# EasyEDA schematic SCH - USB Passthrough v2.0.json
TITLE: USB Passthrough Board; REV: 2.0; Date: 2023-07-30; Sheet: 1/1; Drawn By: TheTrain; Company: Open Stick Community
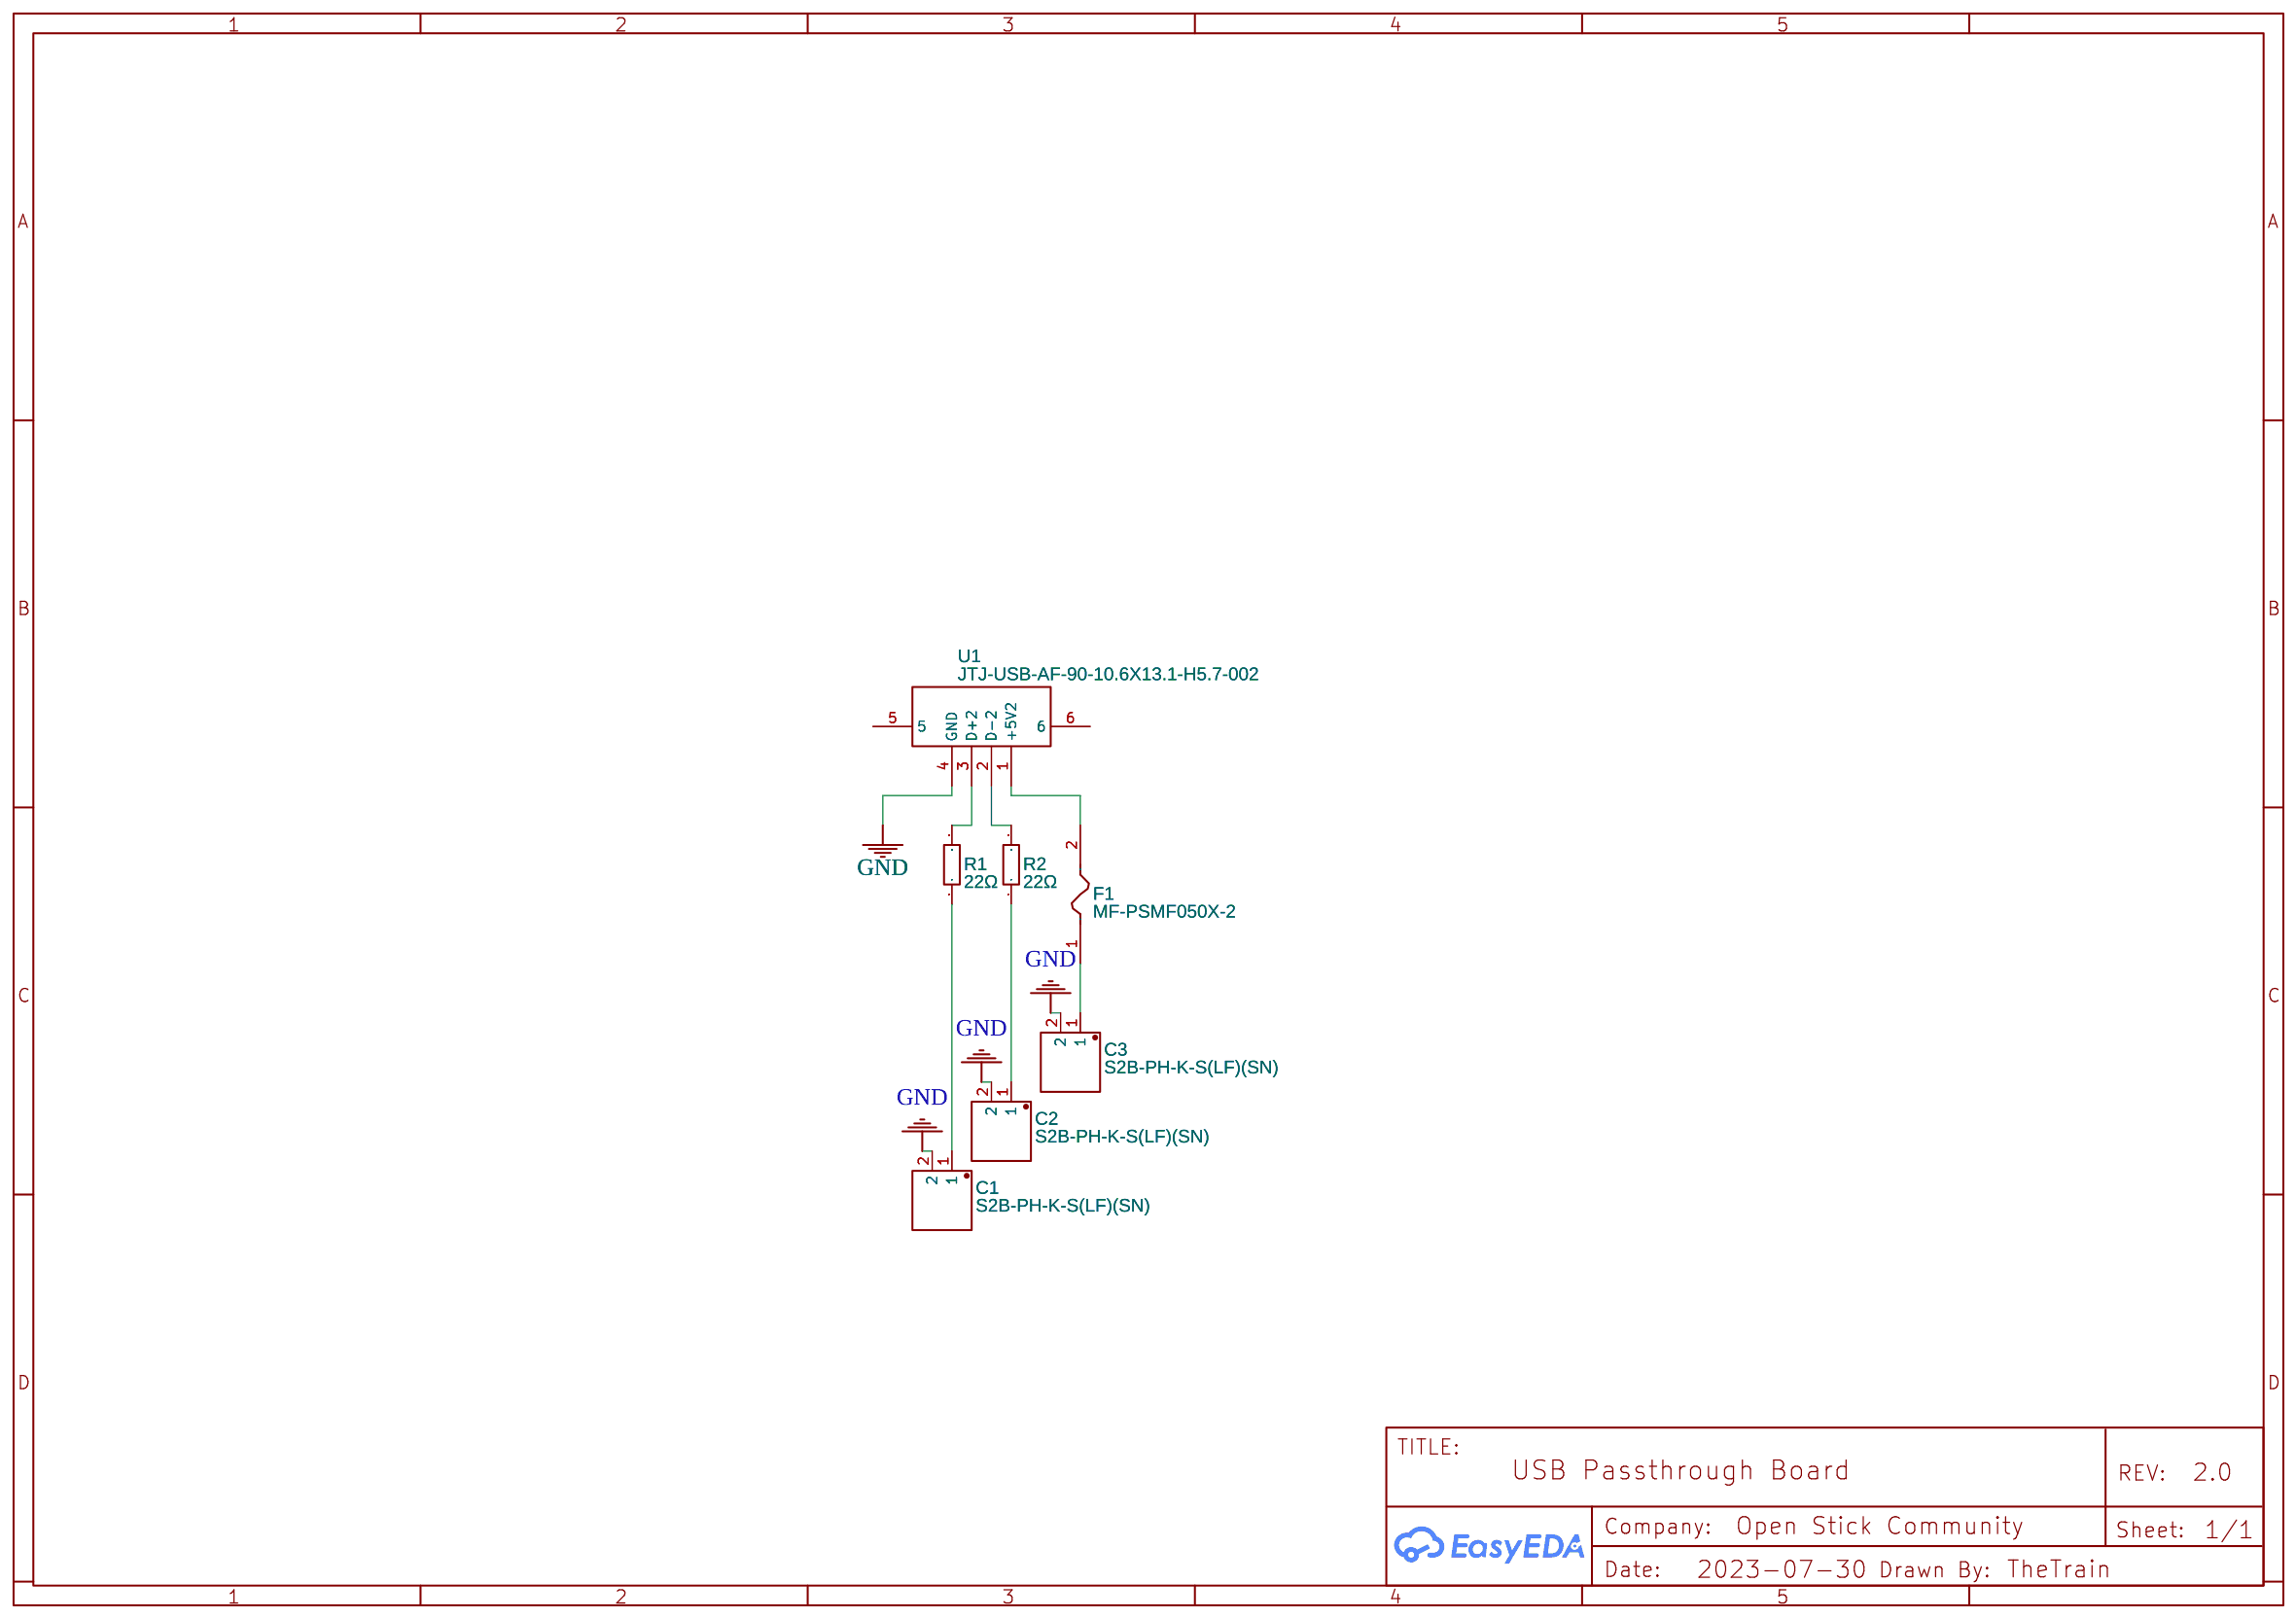
[diagram p0: schematic sheet]

## Parts
C1  S2B-PH-K-S(LF)(SN)  [CONN-TH_S2B-PH-K-S-LF-SN]
C2  S2B-PH-K-S(LF)(SN)  [CONN-TH_S2B-PH-K-S-LF-SN]
C3  S2B-PH-K-S(LF)(SN)  [CONN-TH_S2B-PH-K-S-LF-SN]
F1  MF-PSMF050X-2  [F0805]
R1  22Ω  [R0603]
R2  22Ω  [R0603]
U1  JTJ-USB-AF-90-10.6X13.1-H5.7-002  [USB-A-TH_C42425]

## Library data of the parts
C1-C3 = S2B-PH-K-S(LF)(SN): Contributor: LCSC; Supplier: LCSC; Supplier Part: C173752; Manufacturer: JST; JLCPCB Part Class: Extended Part; link: https://lcsc.com/eda_search?q=C173752&%26type=1&ref=editor
F1 = MF-PSMF050X-2: Supplier: LCSC; Manufacturer: BOURNS; Supplier Part: C116170; JLCPCB Part Class: Extended Part; link: https://lcsc.com/eda_search?q=C116170&%26type=1&ref=editor
R1 R2 = 0603WAF220JT5E: Supplier: LCSC; Manufacturer: UNI-ROYAL(厚声); Supplier Part: C23345; JLCPCB Part Class: Basic Part; link: https://lcsc.com/eda_search?q=C23345&%26type=1&ref=editor
U1 = JTJ-USB-AF-90-10.6X13.1-H5.7-002: Contributor: LCSC; Supplier: LCSC; Supplier Part: C42425; Manufacturer: 精拓金; Manufacturer Part: 912-121A2026S10100; JLCPCB Part Class: Extended Part; link: https://lcsc.com/eda_search?q=C42425&%26type=1&ref=editor

## Nets
GND: C1.2 C2.2 C3.2 U1.4(GND)
Net-(C1-1): C1.1 R1.1
Net-(C2-1): C2.1 R2.1
Net-(C3-1): C3.1 F1.1
Net-(F1-2): F1.2 U1.1(+5V2)
Net-(R1-2): R1.2 U1.3(D+2)
Net-(R2-2): R2.2 U1.2(D-2)

Not connected (* = marked no-connect by the designer): U1 5 6
